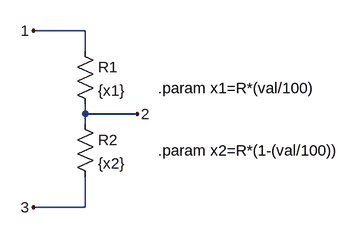
[diagram p0: schematic pot.asc]
pot.asc, the LTspice schematic file:
Version 4
SHEET 1 880 680
WIRE 208 -16 128 -16
WIRE 208 16 208 -16
WIRE 208 112 208 96
WIRE 288 112 208 112
WIRE 208 128 208 112
WIRE 208 256 208 208
WIRE 208 256 128 256
FLAG 128 -16 1
FLAG 128 256 3
FLAG 288 112 2
SYMBOL res 192 0 R0
SYMATTR InstName R1
SYMATTR Value {x1}
SYMBOL res 192 112 R0
SYMATTR InstName R2
SYMATTR Value {x2}
TEXT 320 72 Left 2 !.param x1=R*(val/100)
TEXT 320 168 Left 2 !.param x2=R*(1-(val/100))

The netlist it stands for:
* pot.asc
R1 1 2 {x1}
R2 2 3 {x2}
.param x1=R*(val/100)
.param x2=R*(1-(val/100))
.backanno
.end